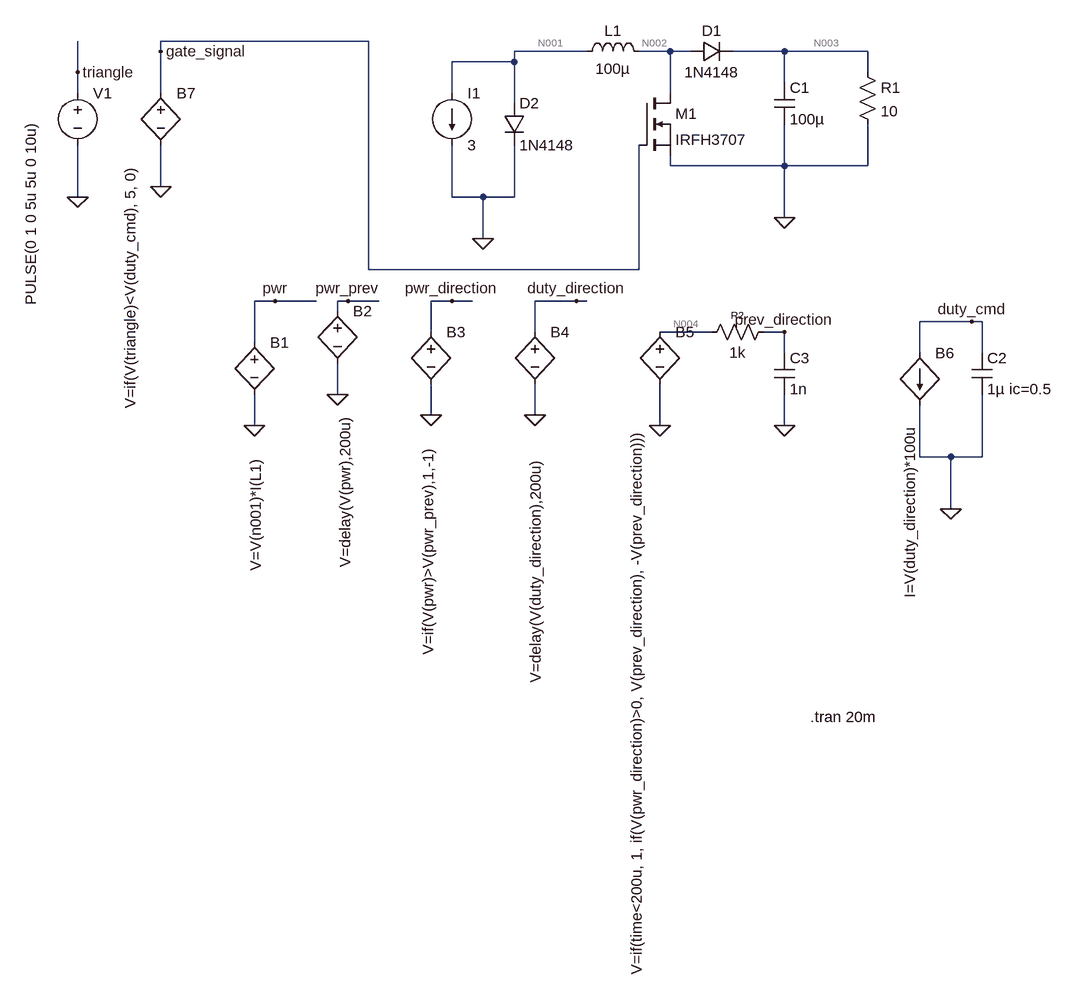
[diagram p0: schematic pv_boost_mppt_attempt.asc]
pv_boost_mppt_attempt.asc, the LTspice schematic file:
Version 4.1
SHEET 1 1096 1664
WIRE -320 64 -640 64
WIRE -640 80 -640 64
WIRE 16 80 -96 80
WIRE 144 80 96 80
WIRE 176 80 144 80
WIRE 320 80 240 80
WIRE 448 80 320 80
WIRE -96 96 -96 80
WIRE -96 96 -192 96
WIRE -768 112 -768 64
WIRE 448 112 448 80
WIRE 320 128 320 80
WIRE -768 144 -768 112
WIRE -640 144 -640 80
WIRE -192 144 -192 96
WIRE 144 144 144 80
WIRE -96 160 -96 96
WIRE 144 256 144 240
WIRE 320 256 320 192
WIRE 320 256 144 256
WIRE 448 256 448 192
WIRE 448 256 320 256
WIRE -640 288 -640 224
WIRE -768 304 -768 224
WIRE -192 304 -192 224
WIRE -144 304 -192 304
WIRE -96 304 -96 224
WIRE -96 304 -144 304
WIRE 320 336 320 256
WIRE -144 368 -144 304
WIRE -320 416 -320 64
WIRE 96 416 96 224
WIRE 96 416 -320 416
WIRE -464 464 -496 464
WIRE -400 464 -464 464
WIRE -352 464 -368 464
WIRE -304 464 -352 464
WIRE -192 464 -224 464
WIRE -160 464 -192 464
WIRE 0 464 -64 464
WIRE 16 464 0 464
WIRE -368 480 -368 464
WIRE 608 496 528 496
WIRE 624 496 608 496
WIRE -224 512 -224 464
WIRE -64 512 -64 464
WIRE 208 512 128 512
WIRE 320 512 288 512
WIRE -496 528 -496 464
WIRE 320 544 320 512
WIRE 528 544 528 496
WIRE 624 544 624 496
WIRE -368 608 -368 560
WIRE -224 640 -224 592
WIRE -64 640 -64 592
WIRE -496 656 -496 608
WIRE 128 656 128 592
WIRE 320 656 320 608
WIRE 528 704 528 624
WIRE 576 704 528 704
WIRE 624 704 624 608
WIRE 624 704 576 704
WIRE 576 784 576 704
FLAG 320 336 0
FLAG -144 368 0
FLAG -496 656 0
FLAG -368 608 0
FLAG -464 464 pwr
FLAG -352 464 pwr_prev
FLAG -224 640 0
FLAG -192 464 pwr_direction
FLAG 0 464 duty_direction
FLAG 320 512 prev_direction
FLAG 608 496 duty_cmd
FLAG -768 112 triangle
FLAG -640 80 gate_signal
FLAG -640 288 0
FLAG -768 304 0
FLAG 576 784 0
FLAG -64 640 0
FLAG 320 656 0
FLAG 128 656 0
DATAFLAG 240 512 ""
SYMBOL cap 304 128 R0
SYMATTR InstName C1
SYMATTR Value 100µ
SYMBOL ind 0 96 R270
WINDOW 0 32 56 VTop 2
WINDOW 3 5 56 VBottom 2
SYMATTR InstName L1
SYMATTR Value 100µ
SYMATTR SpiceLine Rser=1m
SYMBOL diode 176 96 R270
WINDOW 0 32 32 VTop 2
WINDOW 3 0 32 VBottom 2
SYMATTR InstName D1
SYMATTR Value 1N4148
SYMBOL res 432 96 R0
SYMATTR InstName R1
SYMATTR Value 10
SYMBOL nmos 96 144 R0
SYMATTR InstName M1
SYMATTR Value IRFH3707
SYMBOL current -192 144 R0
WINDOW 123 0 0 Left 0
WINDOW 39 0 0 Left 0
SYMATTR InstName I1
SYMATTR Value 3
SYMBOL diode -112 160 R0
SYMATTR InstName D2
SYMATTR Value 1N4148
SYMBOL bv -496 512 R0
WINDOW 3 2 368 VLeft 2
SYMATTR InstName B1
SYMATTR Value V=V(n001)*I(L1)
SYMBOL bv -368 464 R0
WINDOW 3 12 410 VLeft 2
SYMATTR InstName B2
SYMATTR Value V=delay(V(pwr),200u)
SYMBOL bv -224 496 R0
WINDOW 3 11 351 VBottom 2
SYMATTR InstName B3
SYMATTR Value V=if(V(pwr)>V(pwr_prev),1,-1)
SYMBOL bv -64 496 R0
WINDOW 3 1 556 VLeft 2
SYMATTR InstName B4
SYMATTR Value V=delay(V(duty_direction),200u)
SYMBOL bv 128 496 R0
WINDOW 3 -36 1006 VLeft 2
SYMATTR InstName B5
SYMATTR Value V=if(time<200u, 1, if(V(pwr_direction)>0, V(prev_direction), -V(prev_direction)))
SYMBOL bi 528 544 R0
WINDOW 3 -15 377 VLeft 2
SYMATTR InstName B6
SYMATTR Value I=V(duty_direction)*100u
SYMBOL cap 608 544 R0
SYMATTR InstName C2
SYMATTR Value 1µ ic=0.5
SYMBOL voltage -768 128 R0
WINDOW 3 -72 343 VLeft 2
WINDOW 123 0 0 Left 0
WINDOW 39 0 0 Left 0
SYMATTR InstName V1
SYMATTR Value PULSE(0 1 0 5u 5u 0 10u)
SYMBOL bv -640 128 R0
WINDOW 3 -47 502 VLeft 2
SYMATTR InstName B7
SYMATTR Value V=if(V(triangle)<V(duty_cmd), 5, 0)
SYMBOL cap 304 544 R0
SYMATTR InstName C3
SYMATTR Value 1n
SYMBOL res 304 496 R90
WINDOW 0 0 56 VBottom 1
WINDOW 3 32 56 VTop 2
SYMATTR InstName R2
SYMATTR Value 1k
TEXT 360 1104 Left 2 !.tran 20m

The netlist it stands for:
* pv_boost_mppt_attempt.asc
C1 N003 0 100µ
L1 N001 N002 100µ Rser=1m
D1 N002 N003 1N4148
R1 N003 0 10
M1 N002 gate_signal 0 0 IRFH3707
I1 N001 0 3
D2 N001 0 1N4148
B1 pwr 0 V=V(n001)*I(L1)
B2 pwr_prev 0 V=delay(V(pwr),200u)
B3 pwr_direction 0 V=if(V(pwr)>V(pwr_prev),1,-1)
B4 duty_direction 0 V=delay(V(duty_direction),200u)
B5 N004 0 V=if(time<200u, 1, if(V(pwr_direction)>0, V(prev_direction), -V(prev_direction)))
B6 duty_cmd 0 I=V(duty_direction)*100u
C2 duty_cmd 0 1µ ic=0.5
V1 triangle 0 PULSE(0 1 0 5u 5u 0 10u)
B7 gate_signal 0 V=if(V(triangle)<V(duty_cmd), 5, 0)
C3 prev_direction 0 1n
R2 prev_direction N004 1k
.model D D
.lib standard.dio
.model NMOS NMOS
.model PMOS PMOS
.lib standard.mos
.tran 20m
.backanno
.end

* Results of the author's LTspice run, read from the files saved beside the schematic
* Operating Point, zero values left out:
*   V(duty_cmd) = 500 mV
*   V(gate_signal) = 5 V
*   V(n001) = -58.89 mV
*   V(n002) = -55.89 mV
*   V(n003) = -17.86 nV
*   V(n004) = 1 V
*   V(prev_direction) = 1 V
*   V(pwr) = 176.7 mV
*   V(pwr_direction) = -1 V
*   V(pwr_prev) = 176.7 mV
*   I(D1) = -1.786 nA
*   I(D2) = -1.833 nA
*   I(I1) = 3 A
*   I(L1) = -3 A
*   I(R1) = -1.786 nA
*   Id(M1) = -3 A
*   Is(M1) = 3 A